# Altium schematic sheet block_diagram.SchDoc: System blocks organization and connections
size A4; SheetNumber: 5; SheetTotal: 20; TitleBig: System blocks organization and connections; Desc_line1: The project's global block diagram. Arrows show how modules are interconnected and include net names.; Desc_line2: PCB includes 3 fiducials for fabrication purposes. GND test points are distributed along the PCB for easy access.
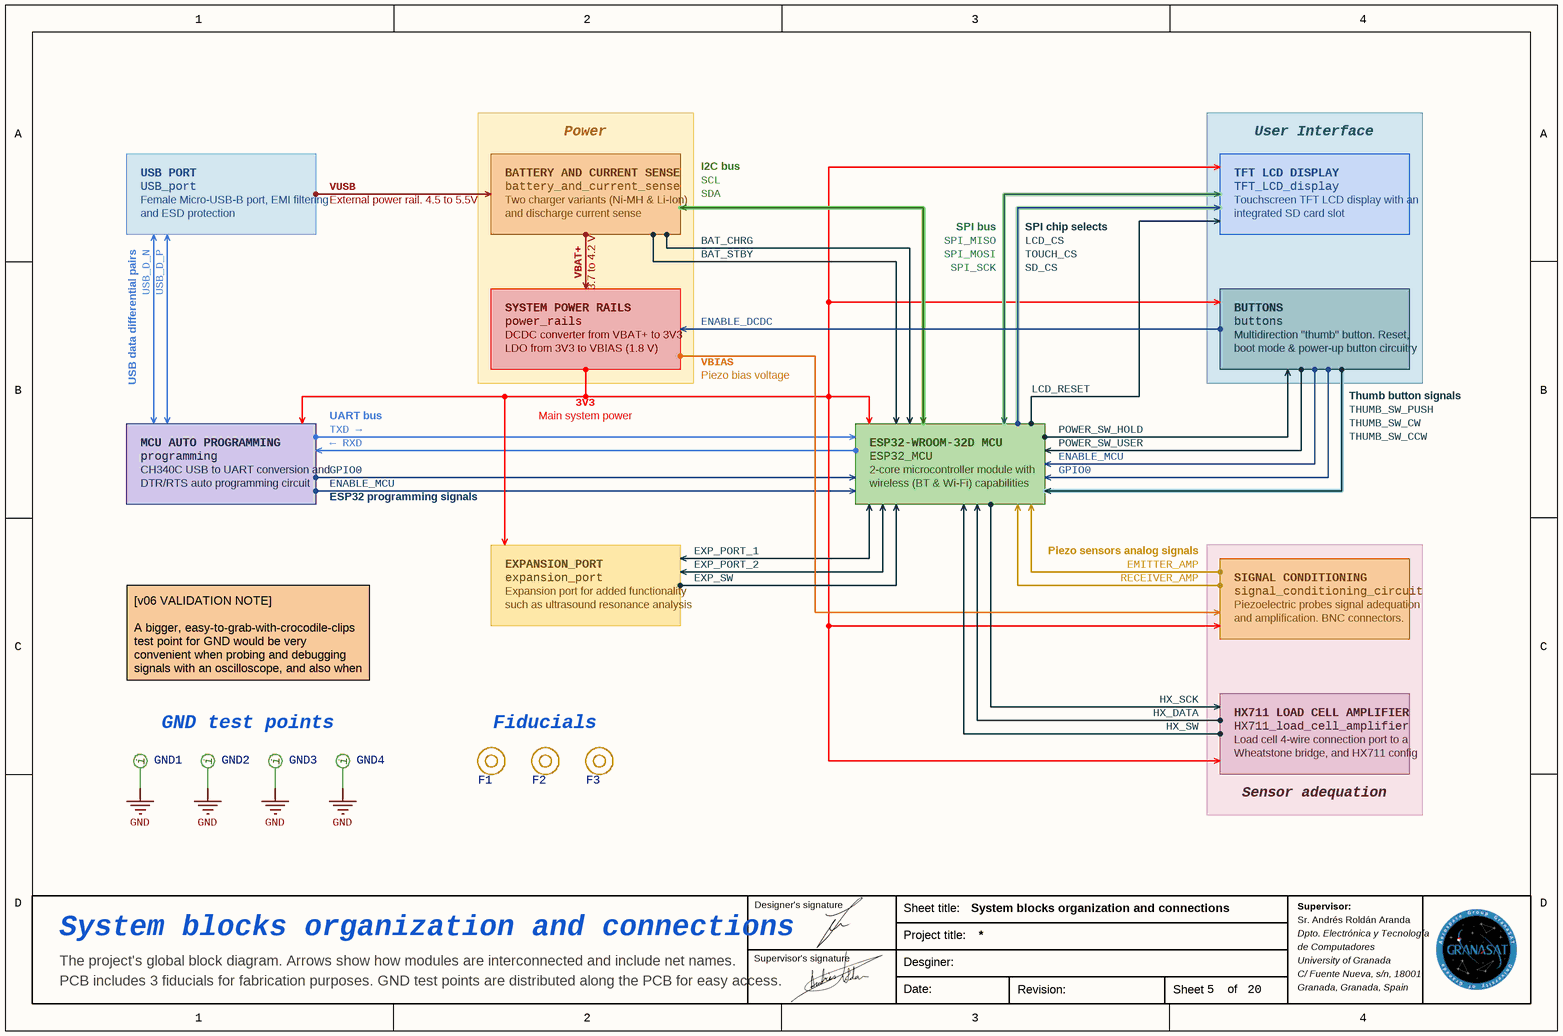
[diagram p0: block_diagram.SchDoc]

## Parts
F1  Fiducial_1mm_2mm  [FIDUCIAL_1MM_2MM]  (value not drawn)  (no BOM)
F2  Fiducial_1mm_2mm  [FIDUCIAL_1MM_2MM]  (value not drawn)  (no BOM)
F3  Fiducial_1mm_2mm  [FIDUCIAL_1MM_2MM]  (value not drawn)  (no BOM)
GND1  Test Point Pad dual sided  [TEST POINT PAD]  (value not drawn)  (no BOM)
GND2  Test Point Pad dual sided  [TEST POINT PAD]  (value not drawn)  (no BOM)
GND3  Test Point Pad dual sided  [TEST POINT PAD]  (value not drawn)  (no BOM)
GND4  Test Point Pad dual sided  [TEST POINT PAD]  (value not drawn)  (no BOM)

## Sub-sheets
BATTERY AND CURRENT SENSE = battery_and_current_sense: no entries
BUTTONS = buttons: no entries
ESP32-WROOM-32D MCU = ESP32_MCU: no entries
EXPANSION_PORT = expansion_port: no entries
HX711 LOAD CELL AMPLIFIER = HX711_load_cell_amplifier: no entries
MCU AUTO PROGRAMMING = programming: no entries
SIGNAL CONDITIONING = signal_conditioning_circuit: no entries
SYSTEM POWER RAILS = power_rails: no entries
TFT LCD DISPLAY = TFT_LCD_display: no entries
USB PORT = USB_port: no entries

## Nets
GND: GND1.1 GND2.1 GND3.1 GND4.1

## Notes on the sheet
- Power
- I2C bus
- User Interface
- USB data differential pairs
- Female Micro-USB-B port, EMI filtering
- and ESD protection
- USB_D_N
- USB_D_P
- VUSB
- External power rail. 4.5 to 5.5V
- Two charger variants (Ni-MH & Li-Ion)
- and discharge current sense
- SDA
- SCL
- BAT_CHRG
- SPI bus
- SPI_MISO
- SPI chip selects
- LCD_CS
- Touchscreen TFT LCD display with an
- integrated SD card slot
- VBAT+
- 3.7 to 4.2 V
- BAT_STBY
- SPI_MOSI
- SPI_SCK
- TOUCH_CS
- SD_CS
- DCDC converter from VBAT+ to 3V3
- LDO from 3V3 to VBIAS (1.8 V)
- ENABLE_DCDC
- VBIAS
- Piezo bias voltage
- Multidirection "thumb" button. Reset,
- boot mode & power-up button circuitry
- TXD →
- ← RXD
- UART bus
- 3V3
- Main system power
- LCD_RESET
- POWER_SW_USER
- POWER_SW_HOLD
- Thumb button signals
- THUMB_SW_CW
- THUMB_SW_PUSH
- THUMB_SW_CCW
- CH340C USB to UART conversion and
- DTR/RTS auto programming circuit
- GPIO0
- ENABLE_MCU
- ESP32 programming signals
- 2-core microcontroller module with
- wireless (BT & Wi-Fi) capabilities
- EXP_PORT_1
- EXP_PORT_2
- EXP_SW
- EMITTER_AMP
- RECEIVER_AMP
- Piezo sensors analog signals
- Expansion port for added functionality
- such as ultrasound resonance analysis
- Piezoelectric probes signal adequation
- and amplification. BNC connectors.
- [v06 VALIDATION NOTE]
  A bigger, easy-to-grab-with-crocodile-clips test point for GND would be very convenient when probing and debugging signals with an oscilloscope, and also when injecting voltage.
- HX_SCK
- HX_DATA
- GND test points
- Fiducials
- HX_SW
- Load cell 4-wire connection port to a
- Wheatstone bridge, and HX711 config
- Sensor adequation
- Designer's signature
- Sheet title:
- Sr. Andrés Roldán Aranda
- Supervisor:
- Supervisor's signature
- Project title:
- Desginer:
- Dpto. Electrónica y Tecnología
- de Computadores
- University of Granada
- C/ Fuente Nueva, s/n, 18001
- Granada, Granada, Spain
- Date:
- Revision:
- Sheet
- of
- (in symbol Test Point Pad dual sided) i

## Library data of the parts
F1-F3 = Fiducial_1mm_2mm: Fiducial 1mm pad, 2mm solder resist
GND1-GND4 = Test Point Pad dual sided: Test point - PCB Pad dual sided